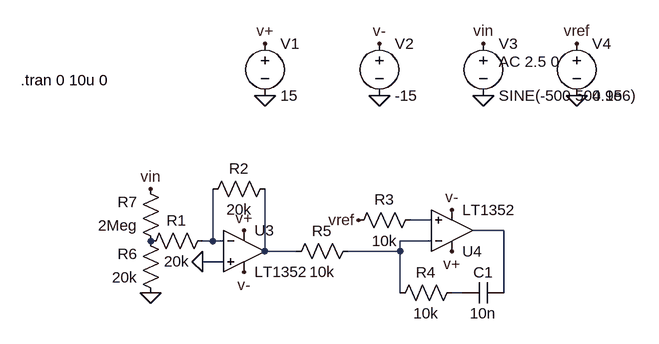
[diagram p0: schematic fdbk.asc]
fdbk.asc, the LTspice schematic file:
Version 4
SHEET 1 880 680
WIRE 432 128 400 128
WIRE 544 144 496 144
WIRE 96 160 96 80
WIRE 96 160 80 160
WIRE 112 160 96 160
WIRE 432 160 384 160
WIRE 176 176 176 80
WIRE 224 176 176 176
WIRE 384 176 384 160
WIRE 384 176 304 176
WIRE 112 192 80 192
WIRE 384 240 384 176
WIRE 480 240 464 240
WIRE 544 240 544 144
FLAG 80 192 0
FLAG 176 -64 0
FLAG 352 -64 0
FLAG 512 -64 0
FLAG 656 -64 0
FLAG 176 -144 v+
FLAG 352 -144 v-
FLAG 512 -144 vin
FLAG 656 -144 vref
FLAG 320 128 vref
FLAG 144 144 v+
FLAG 144 208 v-
FLAG 464 112 v-
FLAG 464 176 v+
FLAG 0 80 vin
FLAG 0 240 0
SYMBOL res 96 144 R90
WINDOW 0 0 56 VBottom 2
WINDOW 3 32 56 VTop 2
SYMATTR InstName R1
SYMATTR Value 20k
SYMBOL res 192 64 R90
WINDOW 0 0 56 VBottom 2
WINDOW 3 32 56 VTop 2
SYMATTR InstName R2
SYMATTR Value 20k
SYMBOL res 416 112 R90
WINDOW 0 0 56 VBottom 2
WINDOW 3 32 56 VTop 2
SYMATTR InstName R3
SYMATTR Value 10k
SYMBOL cap 544 224 R90
WINDOW 0 0 32 VBottom 2
WINDOW 3 32 32 VTop 2
SYMATTR InstName C1
SYMATTR Value 10n
SYMBOL res 480 224 R90
WINDOW 0 0 56 VBottom 2
WINDOW 3 32 56 VTop 2
SYMATTR InstName R4
SYMATTR Value 10k
SYMBOL res 320 160 R90
WINDOW 0 0 56 VBottom 2
WINDOW 3 32 56 VTop 2
SYMATTR InstName R5
SYMATTR Value 10k
SYMBOL voltage 176 -160 R0
WINDOW 123 0 0 Left 2
WINDOW 39 0 0 Left 2
SYMATTR InstName V1
SYMATTR Value 15
SYMBOL voltage 352 -160 R0
WINDOW 123 0 0 Left 2
WINDOW 39 0 0 Left 2
SYMATTR InstName V2
SYMATTR Value -15
SYMBOL voltage 512 -160 R0
WINDOW 123 24 44 Left 2
WINDOW 39 0 0 Left 2
SYMATTR InstName V3
SYMATTR Value SINE(-500 500 1e6)
SYMATTR Value2 AC 2.5 0
SYMBOL voltage 656 -160 R0
WINDOW 123 0 0 Left 2
WINDOW 39 0 0 Left 2
SYMATTR InstName V4
SYMATTR Value 4.95
SYMBOL res 16 256 R180
WINDOW 0 36 76 Left 2
WINDOW 3 36 40 Left 2
SYMATTR InstName R6
SYMATTR Value 20k
SYMBOL res 16 176 R180
WINDOW 0 36 76 Left 2
WINDOW 3 36 40 Left 2
SYMATTR InstName R7
SYMATTR Value 2Meg
SYMBOL Opamps\\LT1352 144 112 R0
SYMATTR InstName U3
SYMBOL Opamps\\LT1352 464 208 M180
SYMATTR InstName U4
TEXT -200 -88 Left 2 !.tran 0 10u 0

The netlist it stands for:
* fdbk.asc
R1 N003 P001 20k
R2 N005 N003 20k
R3 N001 vref 10k
C1 N002 N006 10n
R4 N006 N004 10k
R5 N004 N005 10k
V1 v+ 0 15
V2 v- 0 -15
V3 vin 0 SINE(-500 500 1e6) AC 2.5 0
V4 vref 0 4.95
R6 0 P001 20k
R7 P001 vin 2Meg
XU3 0 N003 v+ v- N005 LT1352  ; pins In+ In- V+ V- OUT
XU4 N001 N004 v+ v- N002 LT1352  ; pins In+ In- V+ V- OUT
.tran 0 10u 0
.lib LTC.lib
.backanno
.end